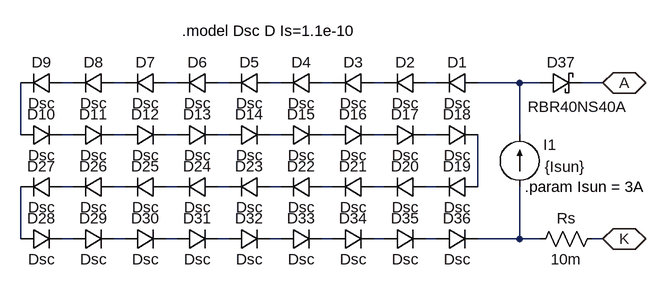
[diagram p0: schematic solar_18V.asc]
solar_18V.asc, the LTspice schematic file:
Version 4
SHEET 1 1668 936
WIRE 208 176 192 176
WIRE 288 176 272 176
WIRE 368 176 352 176
WIRE 448 176 432 176
WIRE 528 176 512 176
WIRE 608 176 592 176
WIRE 688 176 672 176
WIRE 768 176 752 176
WIRE 896 176 832 176
WIRE 928 176 896 176
WIRE 1024 176 992 176
WIRE 128 256 128 176
WIRE 208 256 192 256
WIRE 288 256 272 256
WIRE 368 256 352 256
WIRE 448 256 432 256
WIRE 528 256 512 256
WIRE 608 256 592 256
WIRE 688 256 672 256
WIRE 768 256 752 256
WIRE 896 256 896 176
WIRE 208 336 192 336
WIRE 288 336 272 336
WIRE 368 336 352 336
WIRE 448 336 432 336
WIRE 528 336 512 336
WIRE 608 336 592 336
WIRE 688 336 672 336
WIRE 768 336 752 336
WIRE 832 336 832 256
WIRE 128 416 128 336
WIRE 208 416 192 416
WIRE 288 416 272 416
WIRE 368 416 352 416
WIRE 448 416 432 416
WIRE 528 416 512 416
WIRE 608 416 592 416
WIRE 688 416 672 416
WIRE 768 416 752 416
WIRE 896 416 896 336
WIRE 896 416 832 416
WIRE 928 416 896 416
WIRE 1024 416 1008 416
FLAG 1024 176 A
IOPIN 1024 176 BiDir
FLAG 1024 416 K
IOPIN 1024 416 BiDir
SYMBOL current 896 336 R180
WINDOW 0 -57 65 Left 2
WINDOW 3 -101 31 Left 2
SYMATTR InstName I1
SYMATTR Value {Isun}
SYMBOL diode 832 160 R90
WINDOW 3 32 32 VTop 2
WINDOW 0 0 32 VBottom 2
SYMATTR Value Dsc
SYMATTR InstName D1
SYMBOL res 1024 400 R90
WINDOW 0 0 56 VBottom 2
WINDOW 3 32 56 VTop 2
SYMATTR InstName Rs
SYMATTR Value 10m
SYMBOL diode 752 160 R90
WINDOW 3 32 32 VTop 2
WINDOW 0 0 32 VBottom 2
SYMATTR Value Dsc
SYMATTR InstName D2
SYMBOL diode 672 160 R90
WINDOW 3 32 32 VTop 2
WINDOW 0 0 32 VBottom 2
SYMATTR Value Dsc
SYMATTR InstName D3
SYMBOL diode 592 160 R90
WINDOW 3 32 32 VTop 2
WINDOW 0 0 32 VBottom 2
SYMATTR Value Dsc
SYMATTR InstName D4
SYMBOL diode 512 160 R90
WINDOW 3 32 32 VTop 2
WINDOW 0 0 32 VBottom 2
SYMATTR Value Dsc
SYMATTR InstName D5
SYMBOL diode 432 160 R90
WINDOW 3 32 32 VTop 2
WINDOW 0 0 32 VBottom 2
SYMATTR Value Dsc
SYMATTR InstName D6
SYMBOL diode 352 160 R90
WINDOW 3 32 32 VTop 2
WINDOW 0 0 32 VBottom 2
SYMATTR Value Dsc
SYMATTR InstName D7
SYMBOL diode 272 160 R90
WINDOW 3 32 32 VTop 2
WINDOW 0 0 32 VBottom 2
SYMATTR Value Dsc
SYMATTR InstName D8
SYMBOL diode 192 160 R90
WINDOW 3 32 32 VTop 2
WINDOW 0 0 32 VBottom 2
SYMATTR Value Dsc
SYMATTR InstName D9
SYMBOL diode 128 272 R270
WINDOW 3 0 32 VBottom 2
WINDOW 0 32 32 VTop 2
SYMATTR Value Dsc
SYMATTR InstName D10
SYMBOL diode 208 272 R270
WINDOW 3 0 32 VBottom 2
WINDOW 0 32 32 VTop 2
SYMATTR Value Dsc
SYMATTR InstName D11
SYMBOL diode 288 272 R270
WINDOW 3 0 32 VBottom 2
WINDOW 0 32 32 VTop 2
SYMATTR Value Dsc
SYMATTR InstName D12
SYMBOL diode 368 272 R270
WINDOW 3 0 32 VBottom 2
WINDOW 0 32 32 VTop 2
SYMATTR Value Dsc
SYMATTR InstName D13
SYMBOL diode 448 272 R270
WINDOW 3 0 32 VBottom 2
WINDOW 0 32 32 VTop 2
SYMATTR Value Dsc
SYMATTR InstName D14
SYMBOL diode 528 272 R270
WINDOW 3 0 32 VBottom 2
WINDOW 0 32 32 VTop 2
SYMATTR Value Dsc
SYMATTR InstName D15
SYMBOL diode 608 272 R270
WINDOW 3 0 32 VBottom 2
WINDOW 0 32 32 VTop 2
SYMATTR Value Dsc
SYMATTR InstName D16
SYMBOL diode 688 272 R270
WINDOW 3 0 32 VBottom 2
WINDOW 0 32 32 VTop 2
SYMATTR Value Dsc
SYMATTR InstName D17
SYMBOL diode 768 272 R270
WINDOW 3 0 32 VBottom 2
WINDOW 0 32 32 VTop 2
SYMATTR Value Dsc
SYMATTR InstName D18
SYMBOL diode 832 320 R90
WINDOW 3 32 32 VTop 2
WINDOW 0 0 32 VBottom 2
SYMATTR Value Dsc
SYMATTR InstName D19
SYMBOL diode 752 320 R90
WINDOW 3 32 32 VTop 2
WINDOW 0 0 32 VBottom 2
SYMATTR Value Dsc
SYMATTR InstName D20
SYMBOL diode 672 320 R90
WINDOW 3 32 32 VTop 2
WINDOW 0 0 32 VBottom 2
SYMATTR Value Dsc
SYMATTR InstName D21
SYMBOL diode 592 320 R90
WINDOW 3 32 32 VTop 2
WINDOW 0 0 32 VBottom 2
SYMATTR Value Dsc
SYMATTR InstName D22
SYMBOL diode 512 320 R90
WINDOW 3 32 32 VTop 2
WINDOW 0 0 32 VBottom 2
SYMATTR Value Dsc
SYMATTR InstName D23
SYMBOL diode 432 320 R90
WINDOW 3 32 32 VTop 2
WINDOW 0 0 32 VBottom 2
SYMATTR Value Dsc
SYMATTR InstName D24
SYMBOL diode 352 320 R90
WINDOW 3 32 32 VTop 2
WINDOW 0 0 32 VBottom 2
SYMATTR Value Dsc
SYMATTR InstName D25
SYMBOL diode 272 320 R90
WINDOW 3 32 32 VTop 2
WINDOW 0 0 32 VBottom 2
SYMATTR Value Dsc
SYMATTR InstName D26
SYMBOL diode 192 320 R90
WINDOW 3 32 32 VTop 2
WINDOW 0 0 32 VBottom 2
SYMATTR Value Dsc
SYMATTR InstName D27
SYMBOL diode 128 432 R270
WINDOW 3 0 32 VBottom 2
WINDOW 0 32 32 VTop 2
SYMATTR Value Dsc
SYMATTR InstName D28
SYMBOL diode 208 432 R270
WINDOW 3 0 32 VBottom 2
WINDOW 0 32 32 VTop 2
SYMATTR Value Dsc
SYMATTR InstName D29
SYMBOL diode 288 432 R270
WINDOW 3 0 32 VBottom 2
WINDOW 0 32 32 VTop 2
SYMATTR Value Dsc
SYMATTR InstName D30
SYMBOL diode 368 432 R270
WINDOW 3 0 32 VBottom 2
WINDOW 0 32 32 VTop 2
SYMATTR Value Dsc
SYMATTR InstName D31
SYMBOL diode 448 432 R270
WINDOW 3 0 32 VBottom 2
WINDOW 0 32 32 VTop 2
SYMATTR Value Dsc
SYMATTR InstName D32
SYMBOL diode 528 432 R270
WINDOW 3 0 32 VBottom 2
WINDOW 0 32 32 VTop 2
SYMATTR Value Dsc
SYMATTR InstName D33
SYMBOL diode 608 432 R270
WINDOW 3 0 32 VBottom 2
WINDOW 0 32 32 VTop 2
SYMATTR Value Dsc
SYMATTR InstName D34
SYMBOL diode 688 432 R270
WINDOW 3 0 32 VBottom 2
WINDOW 0 32 32 VTop 2
SYMATTR Value Dsc
SYMATTR InstName D35
SYMBOL diode 768 432 R270
WINDOW 3 0 32 VBottom 2
WINDOW 0 32 32 VTop 2
SYMATTR Value Dsc
SYMATTR InstName D36
SYMBOL schottky 928 192 R270
WINDOW 0 32 32 VTop 2
WINDOW 3 -5 57 VBottom 2
SYMATTR InstName D37
SYMATTR Value RBR40NS40A
SYMATTR Description Diode
SYMATTR Type diode
TEXT 376 96 Left 2 !.model Dsc D Is=1.1e-10
TEXT 904 336 Left 2 !.param Isun = 3A

The netlist it stands for:
* solar_18V.asc
I1 N037 N009 {Isun}
D1 N009 N008 Dsc
Rs K N037 10m
D2 N008 N007 Dsc
D3 N007 N006 Dsc
D4 N006 N005 Dsc
D5 N005 N004 Dsc
D6 N004 N003 Dsc
D7 N003 N002 Dsc
D8 N002 N001 Dsc
D9 N001 N010 Dsc
D10 N010 N011 Dsc
D11 N011 N012 Dsc
D12 N012 N013 Dsc
D13 N013 N014 Dsc
D14 N014 N015 Dsc
D15 N015 N016 Dsc
D16 N016 N017 Dsc
D17 N017 N018 Dsc
D18 N018 N027 Dsc
D19 N027 N026 Dsc
D20 N026 N025 Dsc
D21 N025 N024 Dsc
D22 N024 N023 Dsc
D23 N023 N022 Dsc
D24 N022 N021 Dsc
D25 N021 N020 Dsc
D26 N020 N019 Dsc
D27 N019 N028 Dsc
D28 N028 N029 Dsc
D29 N029 N030 Dsc
D30 N030 N031 Dsc
D31 N031 N032 Dsc
D32 N032 N033 Dsc
D33 N033 N034 Dsc
D34 N034 N035 Dsc
D35 N035 N036 Dsc
D36 N036 N037 Dsc
D37 N009 A RBR40NS40A
.model D D
.lib standard.dio
.model Dsc D Is=1.1e-10
.param Isun = 3A
.backanno
.end